# Altium schematic sheet CPU_eMMC_TF.SchDoc
size A3; SheetNumber: 8; SheetTotal: 21
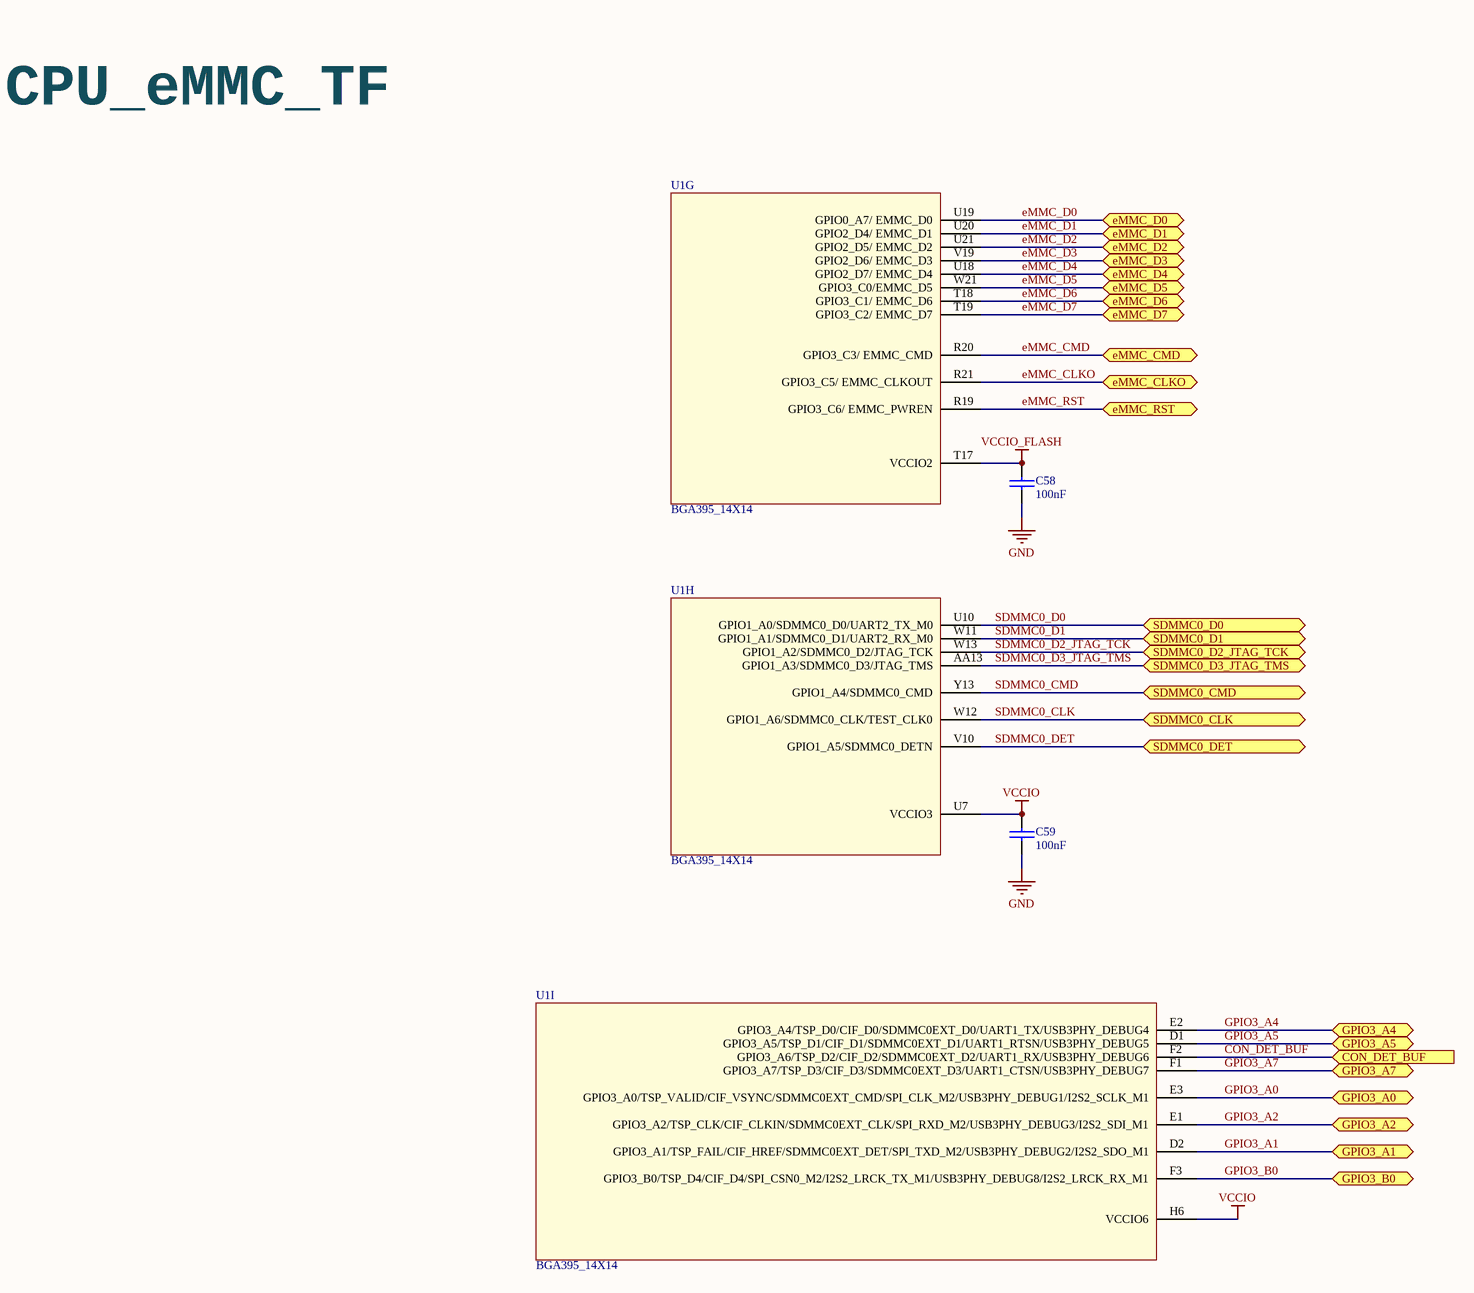
[diagram p0: CPU_eMMC_TF.SchDoc]

## Parts
C58  100nF  [0402_CC - C]
C59  100nF  [0402_CC - C]
U1  BGA395_14X14  [BGA395C65P21X21_1750X1750X117]  (parts G,H,I of 17)

## Ports
CON_DET_BUF (in), eMMC_CLKO (bidir), eMMC_CMD (bidir), eMMC_D0 (bidir), eMMC_D1 (bidir), eMMC_D2 (bidir), eMMC_D3 (bidir), eMMC_D4 (bidir), eMMC_D5 (bidir), eMMC_D6 (bidir), eMMC_D7 (bidir), eMMC_RST (bidir), GPIO3_A0 (bidir), GPIO3_A1 (bidir), GPIO3_A2 (bidir), GPIO3_A4 (bidir), GPIO3_A5 (bidir), GPIO3_A7 (bidir), GPIO3_B0 (bidir), SDMMC0_CLK (bidir), SDMMC0_CMD (bidir), SDMMC0_D0 (bidir), SDMMC0_D1 (bidir), SDMMC0_D2_JTAG_TCK (bidir), SDMMC0_D3_JTAG_TMS (bidir), SDMMC0_DET (bidir)

## Nets
GND: C58.2 C59.2
VCCIO: C59.1 U1.H6(VCCIO6) U1.U7(VCCIO3)
VCCIO_FLASH: C58.1 U1.T17(VCCIO2)
CON_DET_BUF: U1.F2(GPIO3_A6/TSP_D2/CIF_D2/SDMMC0EXT_D2/UART1_RX/USB3PHY_DEBUG6) ; port CON_DET_BUF
eMMC_CLKO: U1.R21(GPIO3_C5/_EMMC_CLKOUT) ; port eMMC_CLKO
eMMC_CMD: U1.R20(GPIO3_C3/_EMMC_CMD) ; port eMMC_CMD
eMMC_D0: U1.U19(GPIO0_A7/_EMMC_D0) ; port eMMC_D0
eMMC_D1: U1.U20(GPIO2_D4/_EMMC_D1) ; port eMMC_D1
eMMC_D2: U1.U21(GPIO2_D5/_EMMC_D2) ; port eMMC_D2
eMMC_D3: U1.V19(GPIO2_D6/_EMMC_D3) ; port eMMC_D3
eMMC_D4: U1.U18(GPIO2_D7/_EMMC_D4) ; port eMMC_D4
eMMC_D5: U1.W21(GPIO3_C0/EMMC_D5) ; port eMMC_D5
eMMC_D6: U1.T18(GPIO3_C1/_EMMC_D6) ; port eMMC_D6
eMMC_D7: U1.T19(GPIO3_C2/_EMMC_D7) ; port eMMC_D7
eMMC_RST: U1.R19(GPIO3_C6/_EMMC_PWREN) ; port eMMC_RST
GPIO3_A0: U1.E3(GPIO3_A0/TSP_VALID/CIF_VSYNC/SDMMC0EXT_CMD/SPI_CLK_M2/USB3PHY_DEBUG1/I2S2_SCLK_M1) ; port GPIO3_A0
GPIO3_A1: U1.D2(GPIO3_A1/TSP_FAIL/CIF_HREF/SDMMC0EXT_DET/SPI_TXD_M2/USB3PHY_DEBUG2/I2S2_SDO_M1) ; port GPIO3_A1
GPIO3_A2: U1.E1(GPIO3_A2/TSP_CLK/CIF_CLKIN/SDMMC0EXT_CLK/SPI_RXD_M2/USB3PHY_DEBUG3/I2S2_SDI_M1) ; port GPIO3_A2
GPIO3_A4: U1.E2(GPIO3_A4/TSP_D0/CIF_D0/SDMMC0EXT_D0/UART1_TX/USB3PHY_DEBUG4) ; port GPIO3_A4
GPIO3_A5: U1.D1(GPIO3_A5/TSP_D1/CIF_D1/SDMMC0EXT_D1/UART1_RTSN/USB3PHY_DEBUG5) ; port GPIO3_A5
GPIO3_A7: U1.F1(GPIO3_A7/TSP_D3/CIF_D3/SDMMC0EXT_D3/UART1_CTSN/USB3PHY_DEBUG7) ; port GPIO3_A7
GPIO3_B0: U1.F3(GPIO3_B0/TSP_D4/CIF_D4/SPI_CSN0_M2/I2S2_LRCK_TX_M1/USB3PHY_DEBUG8/I2S2_LRCK_RX_M1) ; port GPIO3_B0
SDMMC0_CLK: U1.W12(GPIO1_A6/SDMMC0_CLK/TEST_CLK0) ; port SDMMC0_CLK
SDMMC0_CMD: U1.Y13(GPIO1_A4/SDMMC0_CMD) ; port SDMMC0_CMD
SDMMC0_D0: U1.U10(GPIO1_A0/SDMMC0_D0/UART2_TX_M0) ; port SDMMC0_D0
SDMMC0_D1: U1.W11(GPIO1_A1/SDMMC0_D1/UART2_RX_M0) ; port SDMMC0_D1
SDMMC0_D2_JTAG_TCK: U1.W13(GPIO1_A2/SDMMC0_D2/JTAG_TCK) ; port SDMMC0_D2_JTAG_TCK
SDMMC0_D3_JTAG_TMS: U1.AA13(GPIO1_A3/SDMMC0_D3/JTAG_TMS) ; port SDMMC0_D3_JTAG_TMS
SDMMC0_DET: U1.V10(GPIO1_A5/SDMMC0_DETN) ; port SDMMC0_DET

## Notes on the sheet
- CPU_eMMC_TF

## Library data of the parts
C58 C59 = CAP_NP: CLASS: DISCRETE
U1 = RK3328: By AAR